# EAGLE schematic L293_driver (EAGLE 5.07)
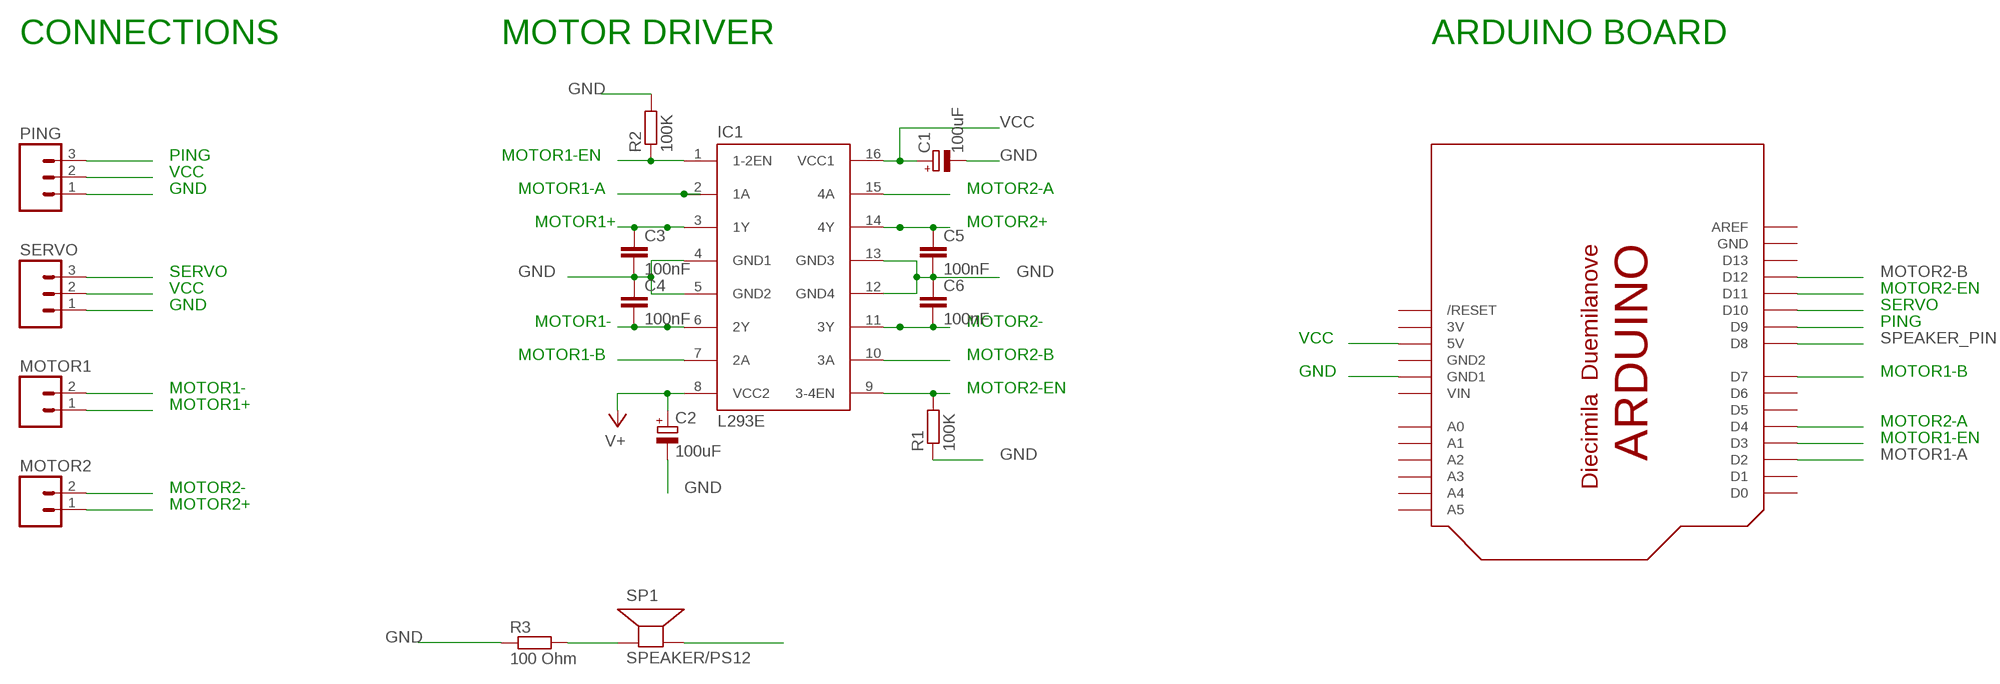
[diagram p0: schematic, sheet 1]

## Parts
C1  100uF  CPOL-EUE3.5-8  [E3,5-8]
C2  100uF  CPOL-EUE3.5-8  [E3,5-8]
C3  100nF  C5/5.5  [C5B5.5]
C4  100nF  C5/5.5  [C5B5.5]
C5  100nF  C5/5.5  [C5B5.5]
C6  100nF  C5/5.5  [C5B5.5]
IC1  L293E  [DIL16]
MOTOR1  M02POLAR  [MOLEX-1X2]
MOTOR2  M02POLAR  [MOLEX-1X2]
PING  M03POLAR  [MOLEX-1X3]
R1  100K  R-EU_0411/12  [0411/12]
R2  100K  R-EU_0411/12  [0411/12]
R3  100 Ohm  R-EU_0207/10  [0207/10]
SERVO  M03POLAR  [MOLEX-1X3]
SP1  SPEAKER/PS12  [PS12]
U$1  ARDUINOUNO  [ARDUINO]

## Nets
GND: C1.- C2.- C3.2 C4.1 C5.2 C6.1 IC1.4(GND1) IC1.5(GND2) IC1.12(GND4) IC1.13(GND3) PING.1 R1.1 R2.2 R3.1 SERVO.1 U$1.GND1
MOTOR1+: C3.1 IC1.3(1Y) MOTOR1.1
MOTOR1-: C4.2 IC1.6(2Y) MOTOR1.2
MOTOR1-A: IC1.2(1A) U$1.D2
MOTOR1-B: IC1.7(2A) U$1.D7
MOTOR1-EN: IC1.1(1-2EN) R2.1 U$1.D3
MOTOR2+: C5.1 IC1.14(4Y) MOTOR2.1
MOTOR2-: C6.2 IC1.11(3Y) MOTOR2.2
MOTOR2-A: IC1.15(4A) U$1.D4
MOTOR2-B: IC1.10(3A) U$1.D12
MOTOR2-EN: IC1.9(3-4EN) R1.2 U$1.D11
N$1: R3.2 SP1.P$1(+)
PING: PING.3 U$1.D9
SERVO: SERVO.3 U$1.D10
SPEAKER_PIN: SP1.P$2(-) U$1.D8
V+: C2.+ IC1.8(VCC2)
VCC: C1.+ IC1.16(VCC1) PING.2 SERVO.2 U$1.5V
Unconnected: U$1.A0 U$1.A1 U$1.A2 U$1.A3 U$1.A4 U$1.A5 U$1.AREF U$1.D0 U$1.D1 U$1.D5 U$1.D6 U$1.D13 U$1.RESET(/RESET)

## Notes on the sheet
- CONNECTIONS | MOTOR DRIVER | ARDUINO BOARD

## Power pins joined to a net without a drawn wire
3V: U$1.3V
GND: U$1.GND
GND2: U$1.GND2
VIN: U$1.VIN

## Library data of the parts
C1 C2 = resistor:CPOL-EU: POLARIZED CAPACITOR, European symbol
C3-C6 = capacitor-wima:C: CAPACITOR naming: grid - package width
IC1 = texas:L293E: TI DEVICE
MOTOR1 MOTOR2 = SparkFun:M02: Header 2 Standard 2-pin 0.1" header. Use with straight break away headers (SKU : PRT-00116), right angle break away headers (PRT-00553), swiss pins (PRT-00743), machine pins (PRT-00117), and female headers (PRT-00115). Molex polarized connector foot print use with SKU : PRT-08233 with associated crimp pins and housings.
PING SERVO = SparkFun:M03: Header 3 Standard 3-pin 0.1" header. Use with straight break away headers (SKU : PRT-00116), right angle break away headers (PRT-00553), swiss pins (PRT-00743), machine pins (PRT-00117), and female headers (PRT-00115). Molex polarized connector foot print use with SKU : PRT-08232 with associated crimp pins and housings.
R1-R3 = resistor:R-EU_: RESISTOR, European symbol
SP1 = adafruit:SPEAKER: SPEAKER Source: Buerklin Added PS12 (for part # PS1240 piezo) http://www.ladyada.net/library/pcb/eaglelibrary.html
U$1 = adafruit:ARDUINO: Arduino Diecimila/Duemilanove Make a shield with ease, this package has all the named pins as well as the two mounting drill holes and an outline of the USB and DC power connector. The outline is on the DIMENSION layer, so if your board house uses it they will cut the outline to match. http://www.ladyada.net/library/pcb/eaglelibrary.html